# EasyEDA schematic SCH_flowMeasurement_2025-10-13.json
TITLE: Sheet_1; REV: 1.0; Date: 2025-09-05; Sheet: 1/1; Company: Your Company
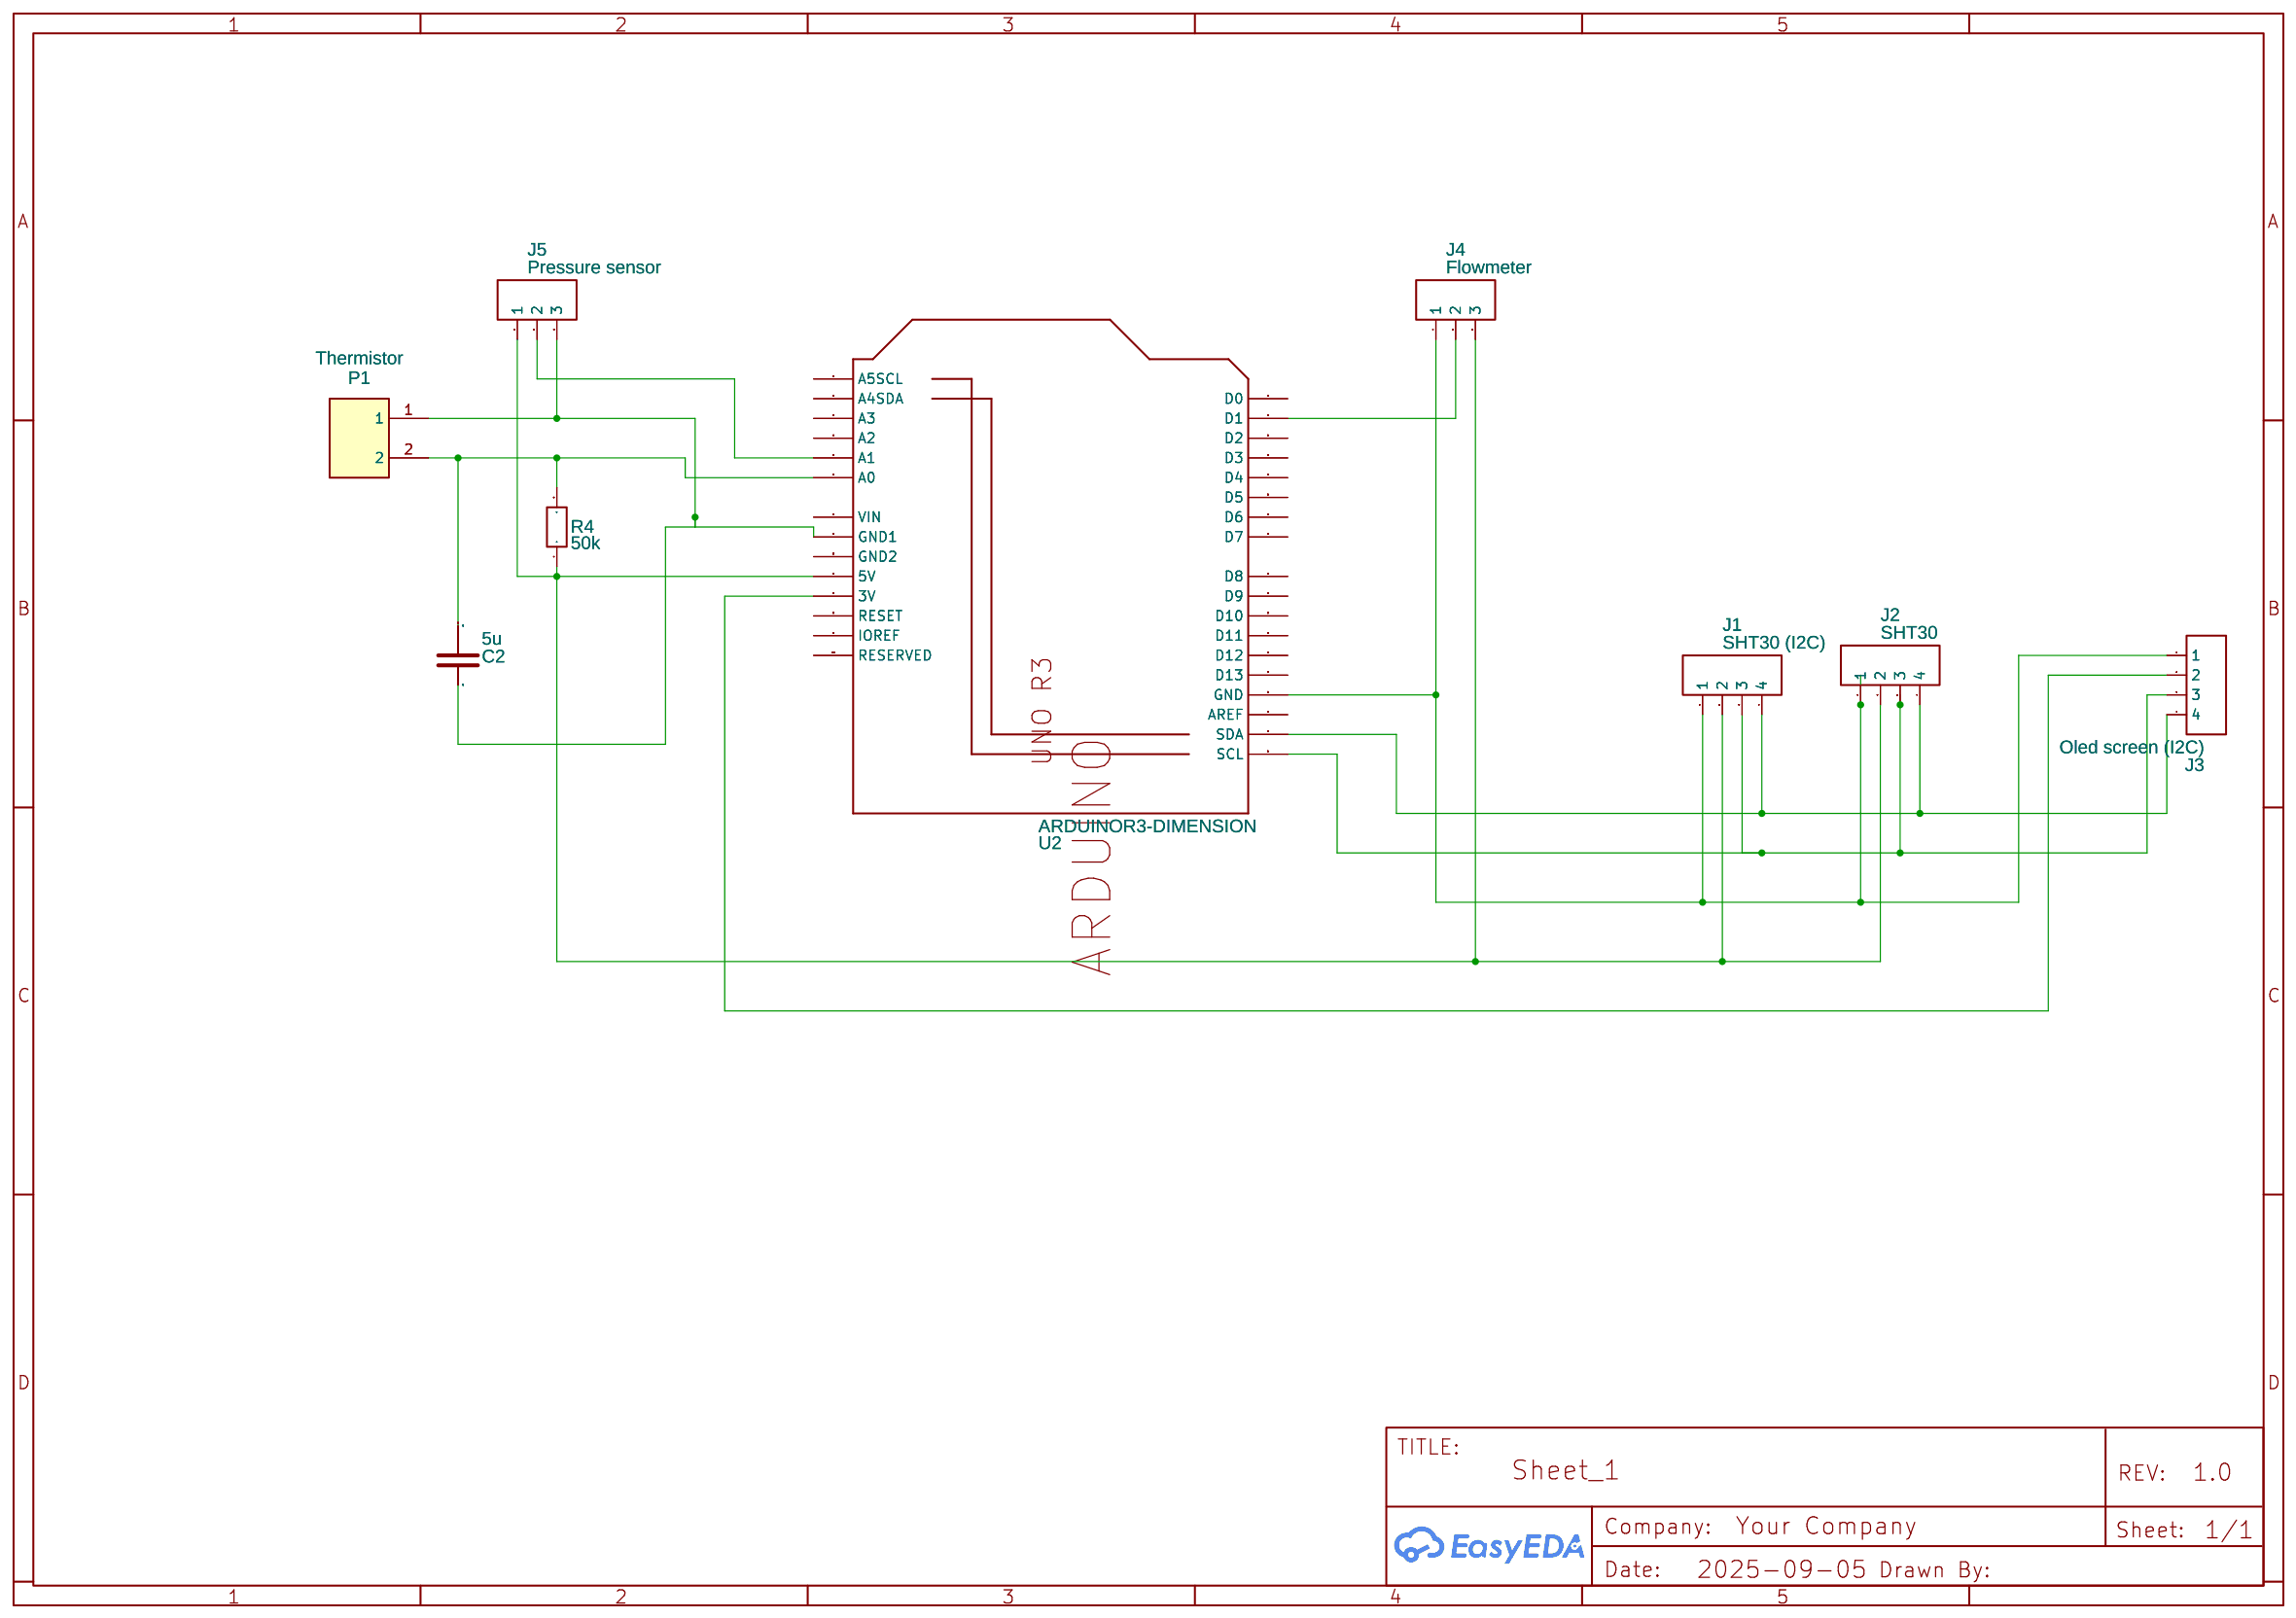
[diagram p0: schematic sheet]

## Parts
C2  5u  [TWO_IO]
J1  SHT30 (I2C)  [HDR-M-2.54_1X4]
J2  SHT30  [HDR-M-2.54_1X4]
J3  Oled screen (I2C)  [HDR-M-2.54_1X4]
J4  Flowmeter  [HDR-M-2.54_1X3]
J5  Pressure sensor  [HDR-M-2.54_1X3]
P1  Thermistor  [CONN-TH_2P-P2.00_PH-2A_C2319]
R4  50k  [R_AXIAL-0.4]
U2  ARDUINOR3-DIMENSION  [ARDUINOR3]

## Library data of the parts
C2 = CAPACITOR
J1-J3 = HDR-M-2.54_1x4: Supplier Part: C124378; Supplier: LCSC; Contributor: LCEDA_Lib
J4 J5 = HDR-M-2.54_1x3: Supplier Part: C180248; Supplier: LCSC; Contributor: LCEDA_Lib
P1 = PH-2A_C2319: Supplier: LCSC; Manufacturer: BOOMELE(博穆精密); Manufacturer Part: PH-2A; Supplier Part: C2319; JLCPCB Part Class: Extended Part
R4 = R_AXIAL-0.4_EU: Contributor: LCEDA_Lib; Package Display: No
U2 = ARDUINOR3-DIMENSION: This is a new object for the new Arduino R3 - with extra pins that you may want to use (such as IOref, and duplicated A4A5; Contributor: Adafruit

## Nets
Net-(C2-P$1): C2.P$1 J5.3 P1.1 U2.GND1
Net-(C2-P$2): C2.P$2 P1.2 R4.2 U2.A0
Net-(J1-1): J1.1 J2.1 J3.1 J4.1 U2.GND
Net-(J1-2): J1.2 J2.2 J4.3 J5.1 R4.1 U2.5V
Net-(J1-3): J1.3 J2.3 J3.3 U2.SCL
Net-(J1-4): J1.4 J2.4 J3.4 U2.SDA
Net-(J3-2): J3.2 U2.3V
Net-(J4-2): J4.2 U2.D1
Net-(J5-2): J5.2 U2.A1

Not connected (* = marked no-connect by the designer): U2 A2 A3 A4(A4SDA) A5(A5SCL) AREF D0 D2 D3 D4 D5 D6 D7 D8 D9 D10 D11 D12 D13 GND2 IOREF RESERVED RESET VIN
